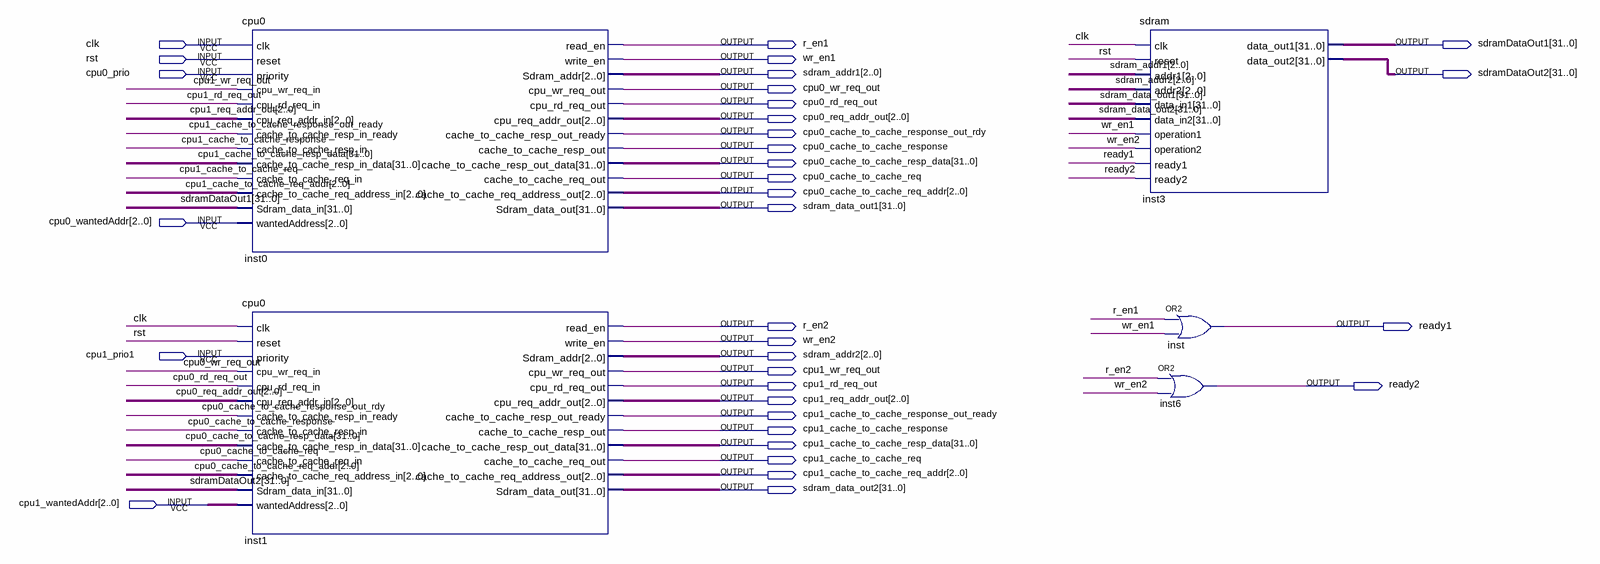
[diagram p0: schematic sheet]
// Quartus schematic TransactionsBetweenCPU.bdf as structural Verilog: 5 symbols, 34 pins
module TransactionsBetweenCPU (
  input  clk,
  input  rst,
  input  cpu0_prio,
  input  [2:0] cpu0_wantedAddr,
  input  cpu1_prio1,
  input  [2:0] cpu1_wantedAddr,
  output r_en1,
  output [31:0] sdramDataOut1,
  output wr_en1,
  output [2:0] sdram_addr1,
  output [31:0] sdramDataOut2,
  output cpu0_wr_req_out,
  output cpu0_rd_req_out,
  output [2:0] cpu0_req_addr_out,
  output cpu0_cache_to_cache_response_out_rdy,
  output cpu0_cache_to_cache_response,
  output [31:0] cpu0_cache_to_cache_resp_data,
  output cpu0_cache_to_cache_req,
  output [2:0] cpu0_cache_to_cache_req_addr,
  output [31:0] sdram_data_out1,
  output r_en2,
  output ready1,
  output wr_en2,
  output [2:0] sdram_addr2,
  output cpu1_wr_req_out,
  output cpu1_rd_req_out,
  output ready2,
  output [2:0] cpu1_req_addr_out,
  output cpu1_cache_to_cache_response_out_ready,
  output cpu1_cache_to_cache_response,
  output [31:0] cpu1_cache_to_cache_resp_data,
  output cpu1_cache_to_cache_req,
  output [2:0] cpu1_cache_to_cache_req_addr,
  output [31:0] sdram_data_out2
);

  cpu0 inst0 (
    .clk(clk), .reset(rst), .\priority (cpu0_prio), .cpu_wr_req_in(cpu1_wr_req_out),
    .cpu_rd_req_in(cpu1_rd_req_out), .cpu_req_addr_in(cpu1_req_addr_out),
    .cache_to_cache_resp_in_ready(cpu1_cache_to_cache_response_out_ready),
    .cache_to_cache_resp_in(cpu1_cache_to_cache_response),
    .cache_to_cache_resp_in_data(cpu1_cache_to_cache_resp_data),
    .cache_to_cache_req_in(cpu1_cache_to_cache_req),
    .cache_to_cache_req_address_in(cpu1_cache_to_cache_req_addr), .Sdram_data_in(sdramDataOut1),
    .wantedAddress(cpu0_wantedAddr), .read_en(r_en1), .write_en(wr_en1), .Sdram_addr(sdram_addr1),
    .cpu_wr_req_out(cpu0_wr_req_out), .cpu_rd_req_out(cpu0_rd_req_out), .cpu_req_addr_out(cpu0_req_addr_out),
    .cache_to_cache_resp_out_ready(cpu0_cache_to_cache_response_out_rdy),
    .cache_to_cache_resp_out(cpu0_cache_to_cache_response),
    .cache_to_cache_resp_out_data(cpu0_cache_to_cache_resp_data),
    .cache_to_cache_req_out(cpu0_cache_to_cache_req),
    .cache_to_cache_req_address_out(cpu0_cache_to_cache_req_addr), .Sdram_data_out(sdram_data_out1));
  cpu0 inst1 (
    .clk(clk), .reset(rst), .\priority (cpu1_prio1), .cpu_wr_req_in(cpu0_wr_req_out),
    .cpu_rd_req_in(cpu0_rd_req_out), .cpu_req_addr_in(cpu0_req_addr_out),
    .cache_to_cache_resp_in_ready(cpu0_cache_to_cache_response_out_rdy),
    .cache_to_cache_resp_in(cpu0_cache_to_cache_response),
    .cache_to_cache_resp_in_data(cpu0_cache_to_cache_resp_data),
    .cache_to_cache_req_in(cpu0_cache_to_cache_req),
    .cache_to_cache_req_address_in(cpu0_cache_to_cache_req_addr), .Sdram_data_in(sdramDataOut2),
    .wantedAddress(cpu1_wantedAddr), .read_en(r_en2), .write_en(wr_en2), .Sdram_addr(sdram_addr2),
    .cpu_wr_req_out(cpu1_wr_req_out), .cpu_rd_req_out(cpu1_rd_req_out), .cpu_req_addr_out(cpu1_req_addr_out),
    .cache_to_cache_resp_out_ready(cpu1_cache_to_cache_response_out_ready),
    .cache_to_cache_resp_out(cpu1_cache_to_cache_response),
    .cache_to_cache_resp_out_data(cpu1_cache_to_cache_resp_data),
    .cache_to_cache_req_out(cpu1_cache_to_cache_req),
    .cache_to_cache_req_address_out(cpu1_cache_to_cache_req_addr), .Sdram_data_out(sdram_data_out2));
  sdram inst3 (
    .clk(clk), .reset(rst), .addr1(sdram_addr1), .addr2(sdram_addr2), .data_in1(sdram_data_out1),
    .data_in2(sdram_data_out2), .operation1(wr_en1), .operation2(wr_en2), .ready1(ready1), .ready2(ready2),
    .data_out1(sdramDataOut1), .data_out2(sdramDataOut2));
  or inst (ready1, r_en1, wr_en1);
  or inst6 (ready2, r_en2, wr_en2);
endmodule
